# EAGLE design X14-Conversion (EAGLE 9.6.2)
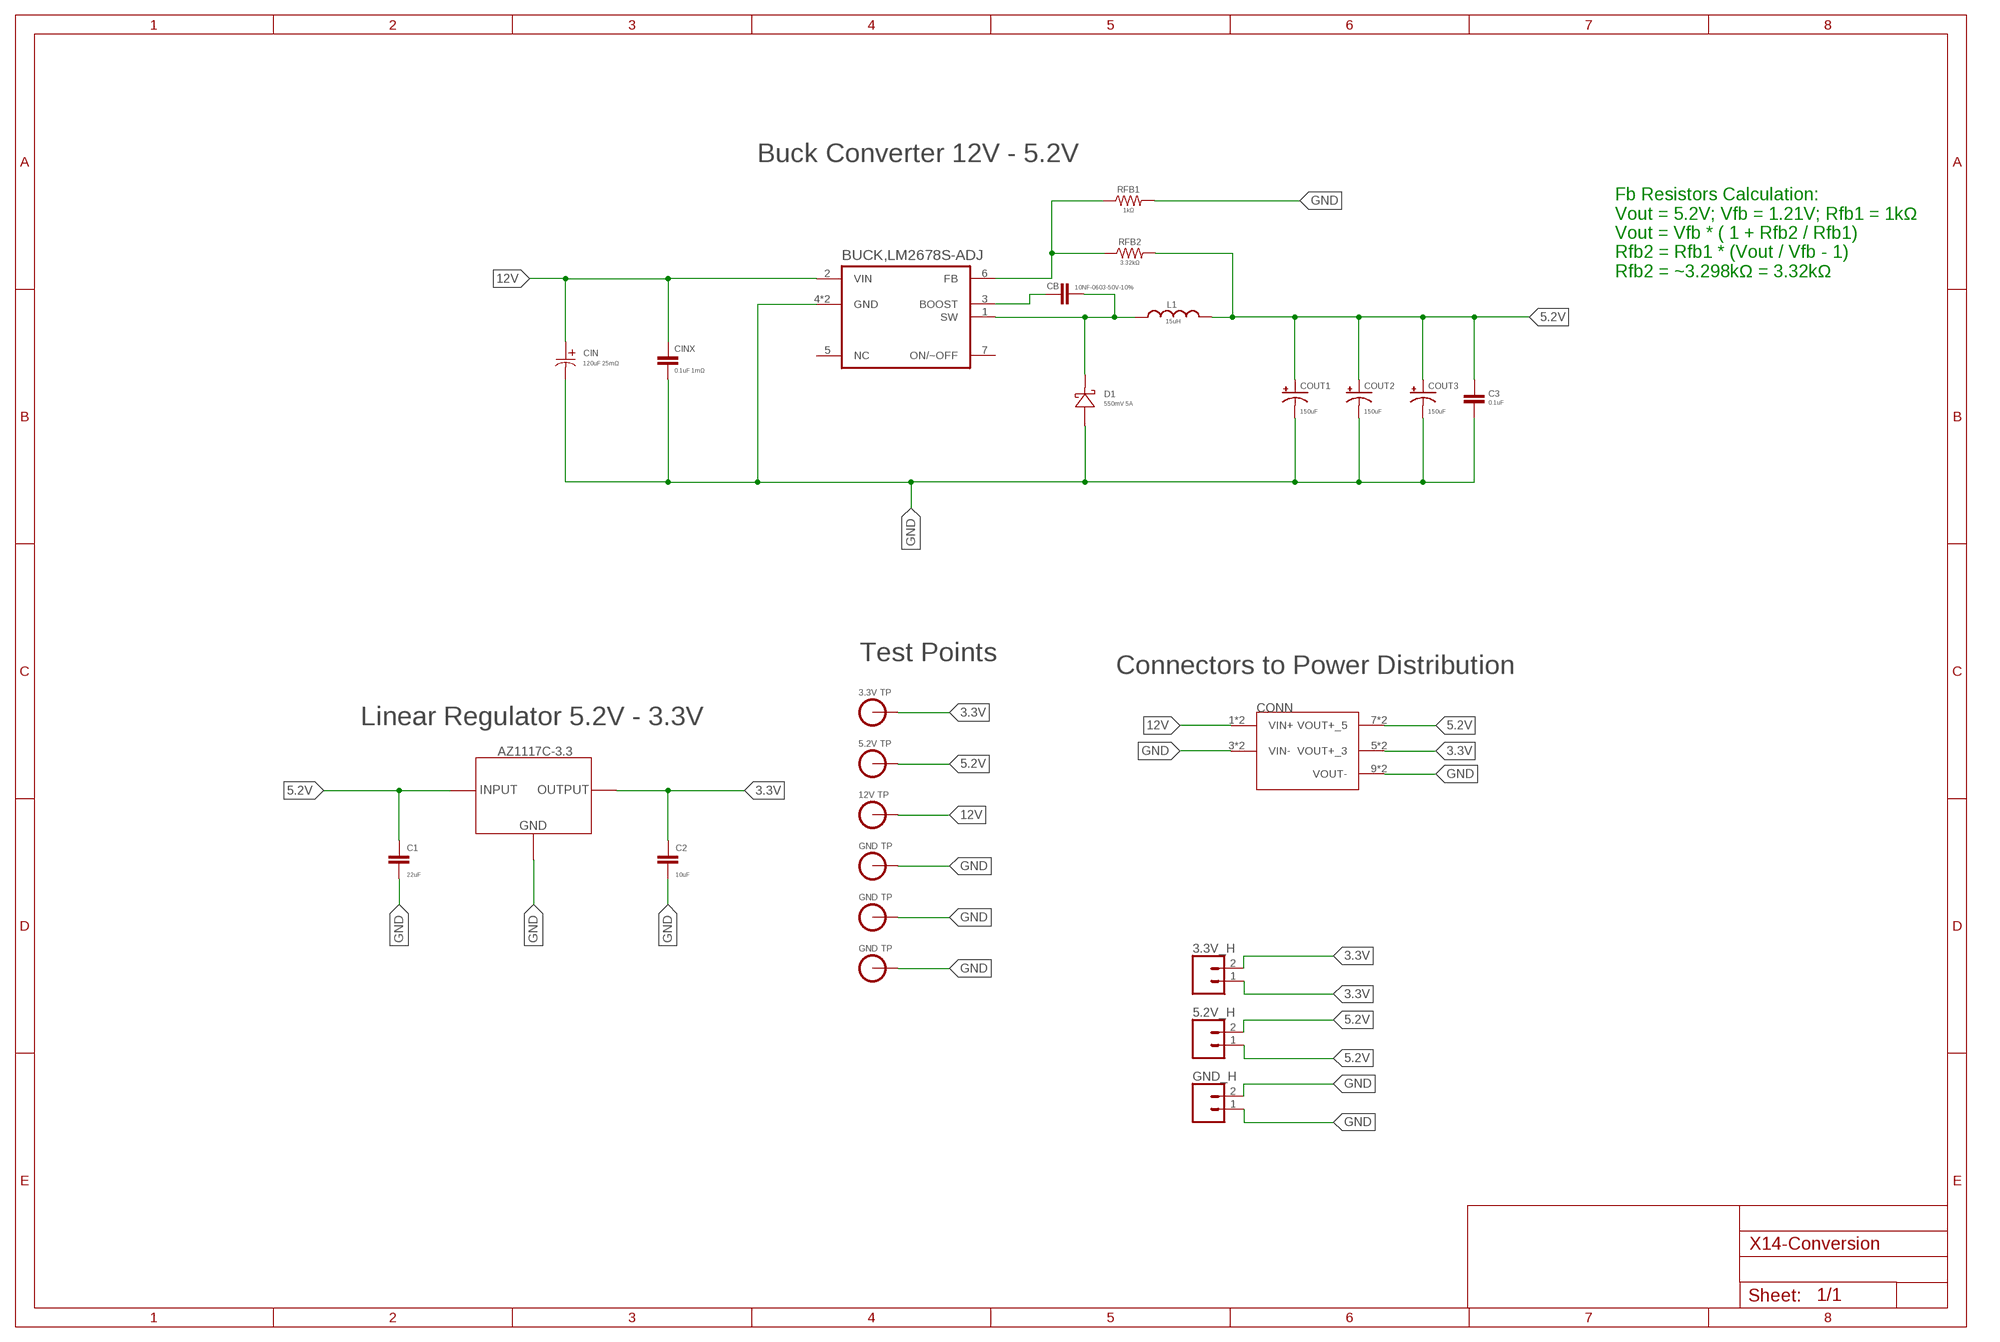
[diagram p0: schematic, sheet 1]

## Parts
3.3V_H  CONN_02  [1X02]
5.2V_H  CONN_02  [1X02]
AZ1117C  AZ1117C-3.3  SOT150P410X160-3N  [SOT150P410X160-3N]
C1  22uF  22UF-0805-6.3V-20%  [0805]
C2  10uF  10UF-0603-6.3V-20%  [0603]
C3  0.1uF  0.1UF-0603-25V-(+80/-20%)  [0603]
CB  10NF-0603-50V-10%  [0603]
CIN  120uF 25mΩ  20SVPF120M  [PCAP_SVP_C6_PAN]
CINX  0.1uF 1mΩ  0.1UF-0603-25V-(+80/-20%)  [0603]
CONN  CONVERSION-DISTRIBUTION  [TSW-105-05-G-S(C-D)]
COUT1  150uF  C-TANTALUM(10UF_150UF)  [2917(7343-31-METRIC)]
COUT2  150uF  C-TANTALUM(10UF_150UF)  [2917(7343-31-METRIC)]
COUT3  150uF  C-TANTALUM(10UF_150UF)  [2917(7343-31-METRIC)]
D1  550mV 5A  CDBG520-G  [CDBG520-G]
GND_H  CONN_02  [1X02]
L1  15uH  HCMA1305  [HCMA1305]
RFB1  1kΩ  1KOHM-0603-1/10W-1%  [0603]
RFB2  3.32kΩ  3.3KOHM-0603-1/10W-1%  [0603]
U1  BUCK,LM2678S-ADJ  [TO127P1435X464-8N]
U$2  3.3V_TESTPOINT  [3.3V_TESTPOINT]
U$3  5.2V_TESTPOINT  [5.2V_TESTPOINT]
U$4  12V_TESTPOINT  [12V_TESTPOINT]
U$5  GND_TESTPOINT  [GND_TESTPOINT]
U$6  GND_TESTPOINT  [GND_TESTPOINT]
U$7  GND_TESTPOINT  [GND_TESTPOINT]

## Nets
3.3V: 3.3V_H.1 3.3V_H.2 AZ1117C.2(OUTPUT) AZ1117C.4(OUTPUT) C2.1 CONN.5(VOUT+_3) CONN.6(VOUT+_3) U$2.3.3V
5.2V: 5.2V_H.1 5.2V_H.2 AZ1117C.3(INPUT) C1.1 C3.1 CONN.7(VOUT+_5) CONN.8(VOUT+_5) COUT1.+ COUT2.+ COUT3.+ L1.2 RFB2.2 U$3.5.2V
12V: CIN.1 CINX.1 CONN.1(VIN+) CONN.2(VIN+) U1.2(VIN) U$4.12V
CB: CB.1 U1.3(BOOST)
FB: RFB1.1 RFB2.1 U1.6(FB)
GND: AZ1117C.1(GND) C1.2 C2.2 C3.2 CIN.2 CINX.2 CONN.3(VIN-) CONN.4(VIN-) CONN.9(VOUT-) CONN.10(VOUT-) COUT1.- COUT2.- COUT3.- D1.2 GND_H.1 GND_H.2 RFB1.2 U1.4(GND) U1.8(GND) U$5.GND U$6.GND U$7.GND
SW: CB.2 D1.1 L1.1 U1.1(SW)
Unconnected: U1.5(NC) U1.7(ON/~OFF)

## Notes on the sheet
- Buck Converter 12V - 5.2V
- Fb Resistors Calculation: 
  Vout = 5.2V; Vfb = 1.21V; Rfb1 = 1kΩ 
  Vout = Vfb * ( 1 + Rfb2 / Rfb1) 
  Rfb2 = Rfb1 * (Vout / Vfb - 1) 
  Rfb2 = ~3.298kΩ = 3.32kΩ
- Test Points
- Connectors to Power Distribution
- Linear Regulator 5.2V - 3.3V

## Library data of the parts
3.3V_H 5.2V_H GND_H = SparkFun-Connectors:CONN_02: Multi connection point. Often used as Generic Header-pin footprint for 0.1 inch spaced/style header connections On any of the 0.1 inch spaced packages, you can populate with these: Break Away Headers - Straight <https://www.sparkfun.com/products/116> (PRT-00116) Break Away Male Headers - Right Angle <https://www.sparkfun.com/products/553> (PRT-00553) Female Headers <https://www.sparkfun.com/products/115> (PRT-00115) Break Away Headers - Machine Pin <https://www.sparkfun.com/products/117> (PRT-00117) Break Away Female Headers - Swiss Machine Pin <https://www.sparkfun.com/products/743> (PRT-00743) For SCREWTERMINALS and SPRING TERMINALS visit here: Screw Terimnals on SparkFun.com <https://www.sparkfun.com/search/results?term=Screw+Terminals> (5mm/3.5mm/2.54mm spacing) This device is also useful as a general connection point to wire up your design to another part of your project. Our various solder wires solder well into these plated through hole pads. Hook-Up Wire - Assortment (Stranded, 22 AWG) <https://www.sparkfun.com/products/11375> (PRT-11375) Hook-Up Wire - Assortment (Solid Core, 22 AWG) <https://www.sparkfun.com/products/11367> (PRT-11367) View the entire wire category on our website here <https://www.sparkfun.com/categories/141> Special notes: Molex polarized connector foot print use with: PRT-08233 with associated crimp pins and housings. 2.54_SCREWTERM for use with PRT-10571. 3.5mm Screw Terminal footprints for PRT-08084 5mm Screw Terminal footprints for use with PRT-08432
AZ1117C = AZ1117C-3.3:SOT150P410X160-3N
C1 = SparkFun-Capacitors:22UF: 22µF ceramic capacitors A capacitor is a passive two-terminal electrical component used to store electrical energy temporarily in an electric field.; PROD_ID: CAP-08402
C2 = SparkFun-Capacitors:10UF: 10.0µF ceramic capacitors A capacitor is a passive two-terminal electrical component used to store electrical energy temporarily in an electric field.; PROD_ID: CAP-11015
C3 = SparkFun-Capacitors:0.1UF: 0.1µF ceramic capacitors A capacitor is a passive two-terminal electrical component used to store electrical energy temporarily in an electric field.; PROD_ID: CAP-00810
CB = SparkFun-Capacitors:10NF: 0.01uF/10nF/10,000pF ceramic capacitors A capacitor is a passive two-terminal electrical component used to store electrical energy temporarily in an electric field. CAP-09321; PROD_ID: CAP-00867; VALUE: 10nF
CIN = 20SVPF120M:20SVPF120M
CINX = SparkFun-Capacitors:0.1UF: 0.1µF ceramic capacitors A capacitor is a passive two-terminal electrical component used to store electrical energy temporarily in an electric field.; PROD_ID: CAP-00810; VALUE: 0.1uF
CONN = CONN, Distribution-Conversion (3):CONVERSION-DISTRIBUTION
COUT1-COUT3 = CAP, Tantalum 150 uF - Kemet 2917 T491:C-TANTALUM(10UF_150UF)
D1 = CDBC520-G_Library:CDBG520-G
L1 = IND, 15uH - hcma1305:HCMA1305: Eaton HCMA1305-150-R Inductor
RFB1 = SparkFun-Resistors:1KOHM: 1kΩ resistor A resistor is a passive two-terminal electrical component that implements electrical resistance as a circuit element. Resistors act to reduce current flow, and, at the same time, act to lower voltage levels within circuits. - Wikipedia; PROD_ID: RES-07856; VALUE: 1k
RFB2 = SparkFun-Resistors:3.3KOHM: 3.3kΩ resistor A resistor is a passive two-terminal electrical component that implements electrical resistance as a circuit element. Resistors act to reduce current flow, and, at the same time, act to lower voltage levels within circuits. - Wikipedia; PROD_ID: RES-07851; VALUE: 3.3k
U1 = BUCK, LM2678S-ADJ:BUCK,LM2678S-ADJ; DESCRIPTION: 8V to 40V, 5A SIMPLE SWITCHER buck converter with high efficiency 7-DDPAK/TO-263 -40 to 125; DIGI-KEY_PART_NUMBER: 2156-LM2678S-ADJ/NOPB-TI-ND; MF: Texas Instruments; MP: LM2678S-ADJ; PACKAGE: TO-263-7 Texas Instruments; PURCHASE-URL: https://pricing.snapeda.com/search/part/LM2678S-ADJ/?ref=eda
U$2 = testpoints:3.3V_TESTPOINT
U$3 = testpoints:5.2V_TESTPOINT
U$4 = testpoints:12V_TESTPOINT
U$5-U$7 = testpoints:GND_TESTPOINT

## Board
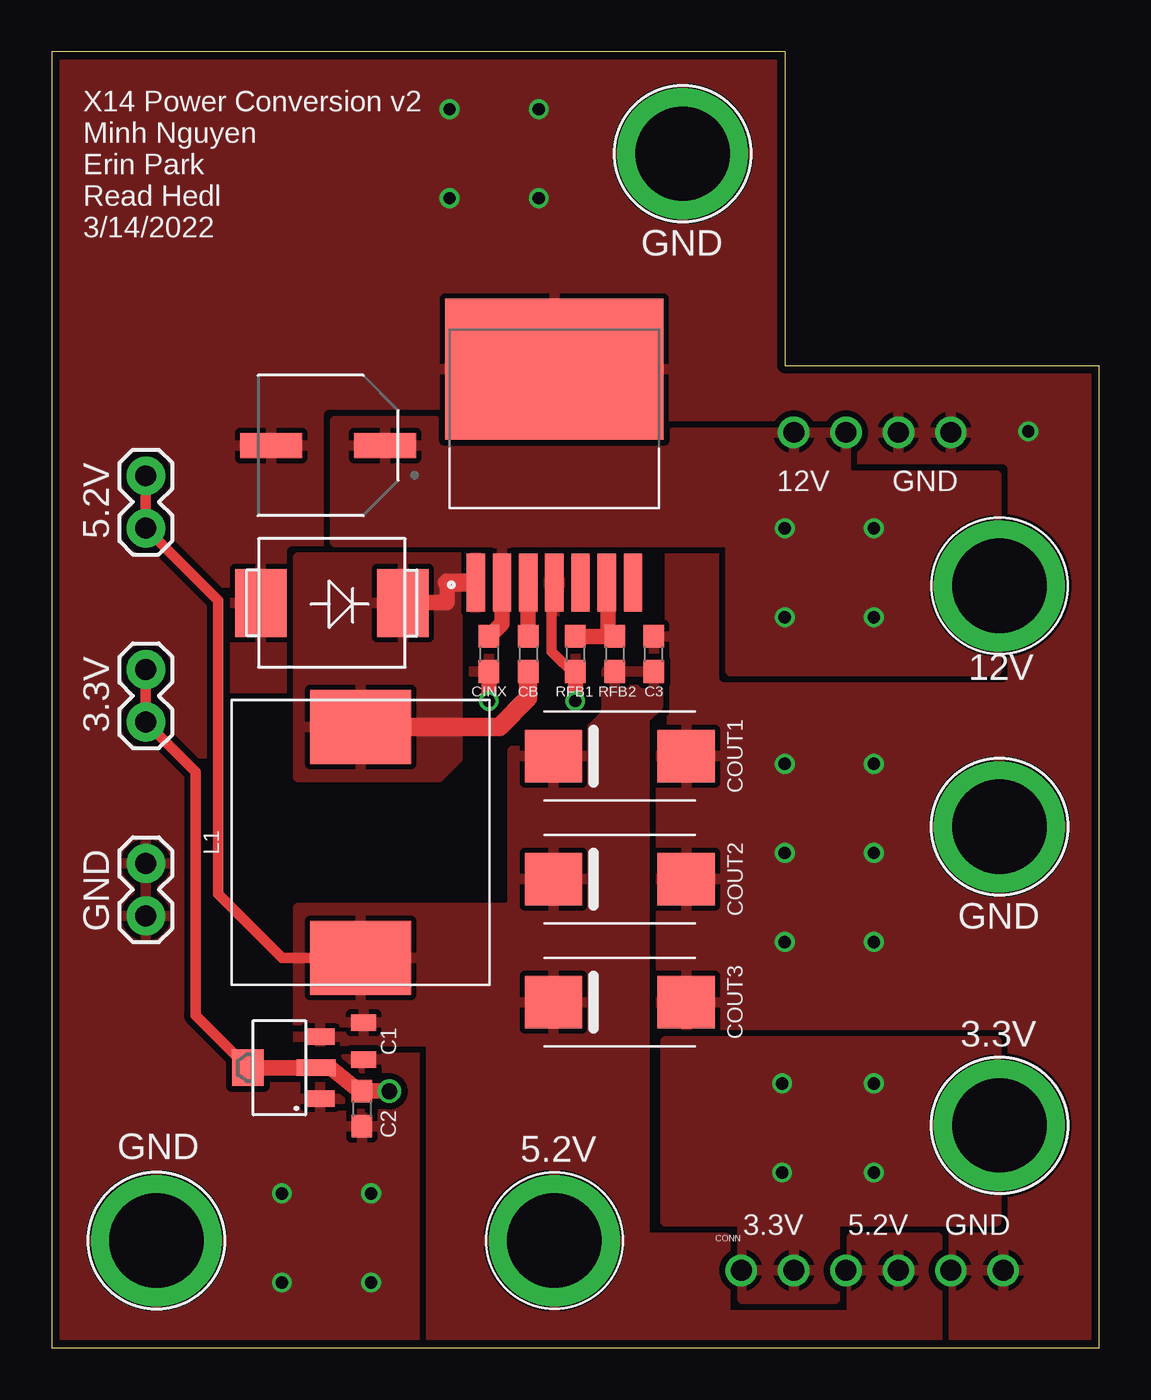
[diagram p1: board, top side]
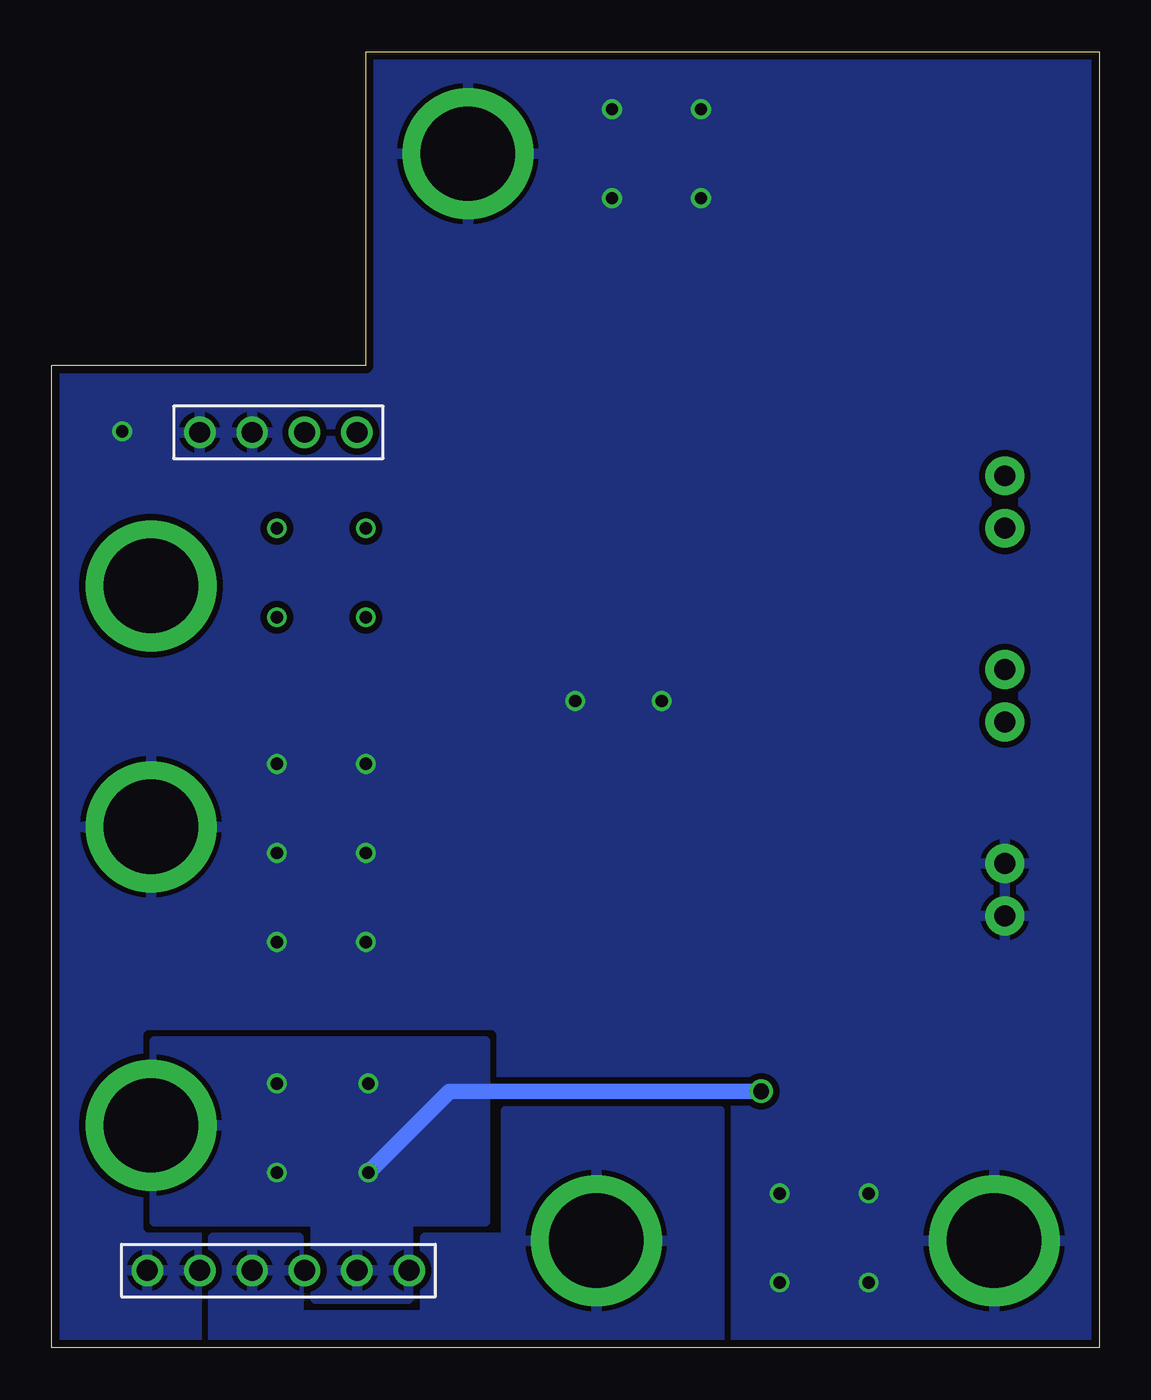
[diagram p2: board, bottom side, seen from below]

Size 50.8 x 62.86 mm. Coordinates in mm from the lower left corner, seen from the top.
Outline: 0,0 50.8,0 50.8,47.62 35.56,47.62 35.56,62.86 0,62.86 0,0
Copper layers (1*16): Top 0.0356mm / dielectric 1.5011mm / Bottom 0.0356mm
Design rules "ECE_Senior_Design": minimum track width 8mil, minimum drill 13mil, track to track 8mil, track to pad 8mil, pad to pad 6mil, via to via 8mil, smd to smd 6mil, copper to edge 15mil, drill to drill 8mil, minimum pad ring 7mil, minimum via ring 7mil, stop-mask expansion 3mil, vias tented up to drill 0mil, thermal gap 10mil

### Footprints (pad centres in the part's own frame; a part is rotated, then mirrored left to right if it is on the bottom)
1X02 = drill 1.016 pad 1.88: 1 0,0; 2 2.54,0
SOT150P410X160-3N = smd 0.8 x 1.4: 1 -1.499,-1.981; 3 1.499,-1.981 | smd 0.8 x 1.905: 2 0,-1.779 | smd 1.778 x 1.524: 4 0,1.524
0805 = smd 0.8 x 1.2: 1 -0.9,0; 2 0.9,0
0603 = smd 1.1 x 1: 1 -0.85,0; 2 0.85,0
PCAP_SVP_C6_PAN = smd 2.997 x 1.219: 1 -2.756,0; 2 2.756,0
TSW-105-05-G-S(C-D) = drill 1.016: 1 3.81,20.32; 2 1.27,20.32; 3 -1.27,20.32; 4 -3.81,20.32; 5 6.35,-20.32; 6 3.81,-20.32; 7 1.27,-20.32; 8 -1.27,-20.32; 9 -3.81,-20.32; 10 -6.35,-20.32
2917(7343-31-METRIC) = smd 2.77 x 2.55: + -3.22,0; - 3.22,0
CDBG520-G = smd 2.5 x 3.3: 1 -3.202,-0.062; 2 3.698,-0.062
HCMA1305 = smd 3.6 x 4.9: 1 -5.6,0; 2 5.6,0
TO127P1435X464-8N = smd 0.89 x 2.79: 1 -3.81,-6.19; 2 -2.54,-6.19; 3 -1.27,-6.19; 4 0,-6.19; 5 1.27,-6.19; 6 2.54,-6.19; 7 3.81,-6.19 | smd 10.58 x 6.84: 8 0,4.16
3.3V_TESTPOINT = drill 4.572 pad 6.35: 3.3V 0,0
5.2V_TESTPOINT = drill 4.572 pad 6.35: 5.2V 0,0
12V_TESTPOINT = drill 4.572 pad 6.35: 12V 0,0
GND_TESTPOINT = drill 4.572 pad 6.35: GND 0,0

### Placement (x,y rotation side)
3.3V_H  4.57,30.35 90 top
5.2V_H  4.57,39.75 90 top
AZ1117C  11.05,13.59 90 top
C1  15.14,14.88 270 top
C2  15.05,11.61 270 top
C3  29.21,33.66 90 top
CB  23.11,33.66 270 top
CIN  13.41,43.76 180 top
CINX  21.21,33.66 270 top
CONN  39.8,24.08 0 bottom
COUT1  27.56,28.7 0 top
COUT2  27.56,22.73 0 top
COUT3  27.56,16.76 0 top
D1  13.84,36.07 180 top
GND_H  4.57,20.96 90 top
L1  14.99,24.51 270 top
RFB1  25.4,33.66 270 top
RFB2  27.3,33.66 270 top
U1  24.38,43.31 0 top
U$2  45.97,10.8 0 top
U$3  24.38,5.21 0 top
U$4  45.97,36.96 0 top
U$5  30.61,57.91 0 top
U$6  5.09,5.2 0 top
U$7  45.97,25.27 0 top

### Tracks (layer width: path | path; a pad name or v marks a point on that pad's centre or on a via)
3.3V  (via drill 0.6, 0.76)
  Top 0.508: C2.1 14.9,12.46 | v16.38,12.45 16.37,12.46 | AZ1117C.4 6.99,16.13 6.99,27.94 3.3V_H.1 3.3V_H.2
  Top 0.61: AZ1117C.2 13.54,13.59
  Top 0.762: 14.9,12.46 13.54,13.59 | 16.37,12.46 C2.1 | AZ1117C.4 AZ1117C.2
  Bottom 0.762: v16.38,12.45 31.5,12.45 v35.43,8.51
  other vias: 39.88,12.83 39.88,8.51 35.43,12.83
  pour Top (isolate 0.305): 29.77,14.88 45.81,14.88 45.81,6.15 38,6.15 38,2.39 33.5,2.39 33.5,6.15 29.77,6.15
  pour Bottom (isolate 0.305): 45.81,14.88 29.77,14.88 29.77,6.15 33.5,6.15 33.5,2.39 38,2.39 38,6.15 45.81,6.15
5.2V
  Top 0.508: 5.2V_H.2 5.2V_H.1 8.08,36.24 8.08,22.02 11.19,18.91 L1.2
  pour Top (isolate 0.305): 29.4,31.13 29.4,32.83 26.92,32.83 26.92,30.76 25.12,28.96 22.35,28.96 22.35,21.55 22.14,21.34 11.96,21.34 11.96,14.88 18.41,14.88 18.41,0.13 42.95,0.13 42.95,5.33 38.81,5.33 38.81,1.57 32.69,1.57 32.69,5.33 28.77,5.33 28.77,30.49
  pour Bottom (isolate 0.305): 18.41,11.51 18.41,0.13 42.95,0.13 42.95,5.33 38.81,5.33 38.81,1.57 32.69,1.57 32.69,5.33 28.77,5.33 28.77,11.51
12V  (via drill 0.6)
  Top 0.762: CINX.1 21.84,35.14 U1.2
  other vias: 39.88,39.75 39.88,35.43 35.56,39.75 35.56,35.43
  pour Top (isolate 0.305): 13.75,44.94 18.6,44.94 18.6,43.55 30.04,43.55 30.17,43.68 30.17,44.4 38.53,44.4 38.53,42.29 45.81,42.29 45.81,32.82 32.93,32.82 32.93,39.08 22.03,39.08 22.03,36.07 21.65,36.07 21.65,39.08 13.75,39.08
CB
  Top 0.762: U1.3 CB.1
CUTOUT1
  cutout Top: 21.69,34.84 22.58,34.84 22.58,31.99 21.69,31.99
CUTOUT2
  cutout Top: 20.04,32.17 22.2,32.17 22.2,30.85 20.04,30.85
CUTOUT3
  cutout Top: 23.85,35.47 24.74,35.47 24.74,30.47 23.85,30.47
CUTOUT4
  cutout Top: 24.74,33.31 26.14,33.31 26.14,30.47 24.74,30.47
CUTOUT5
  cutout Top: 15.24,11.81 15.8,11.81 15.8,11.43 15.24,11.43
CUTOUT6
  cutout Top: 15.23,13.58 15.99,13.58 15.99,13.07 15.23,13.07
CUTOUT7
  cutout Top: 11.4,14.64 12.17,14.64 12.17,12.94 11.4,12.94
CUTOUT8
  cutout Top: 27.91,35.47 28.68,35.47 28.68,33.77 27.91,33.77
CUTOUT9
  cutout Top: 28.93,38.52 29.69,38.52 29.69,35.04 28.93,35.04
FB
  Top 0.508: U1.6 26.99,37.05 | RFB2.1 26.99,34.82
  Top 0.762: RFB1.1 RFB2.1 | 26.99,37.05 26.99,34.82
GND  (via drill 0.6)
  Top 0.406: RFB1.2 25.4,32.64
  Top 0.508: U1.4 24.26,36.99 24.26,33.78 25.4,32.64
  Top 0.762: 25.4,32.64 v25.4,31.37 | CINX.2 v21.21,31.37
  other vias: 39.88,28.32 39.88,24 39.88,19.68 47.37,44.45 35.56,28.32 35.56,24 35.56,19.68 15.49,7.49 15.49,3.18 11.18,7.49 11.18,3.18 23.62,60.07 23.62,55.75 19.3,60.07 19.3,55.75
  pour Top (isolate 0.305, rank 6): 0.13,62.74 35.43,62.74 35.43,47.5 50.67,47.5 50.67,0.13 0.13,0.13
  pour Bottom (isolate 0.305, rank 6): 0.13,62.74 35.43,62.74 35.43,47.5 50.67,47.5 50.67,0.13 0.13,0.13
N$1
  cutout Top: 8.48,31.66 11.28,31.66 11.28,17.39 8.48,17.39
SW
  Top 0.762: 19.18,37.12 19.18,36.14 17.06,36.14 D1.1
  Top 0.889: CB.2 23.11,31.51 21.72,30.11 L1.1 | U1.1 19.18,37.12
  pour Top (isolate 0.305): 11.96,38.33 20.76,38.33 20.76,35.92 19.69,35.92 19.69,28.58 18.8,27.69 11.96,27.69

### Text on the board
tPlace: GND | 12V | GND | 5.2V | 12V | 3.3V | GND | GND | 3.3V | GND | 5.2V | 3.3V | 5.2V | GND
tNames: X14 Power Conversion v2 / Minh Nguyen / Erin Park / Read Hedl / 3/14/2022